# Altium schematic sheet MuxAddr_RAM.SchDoc
size A4
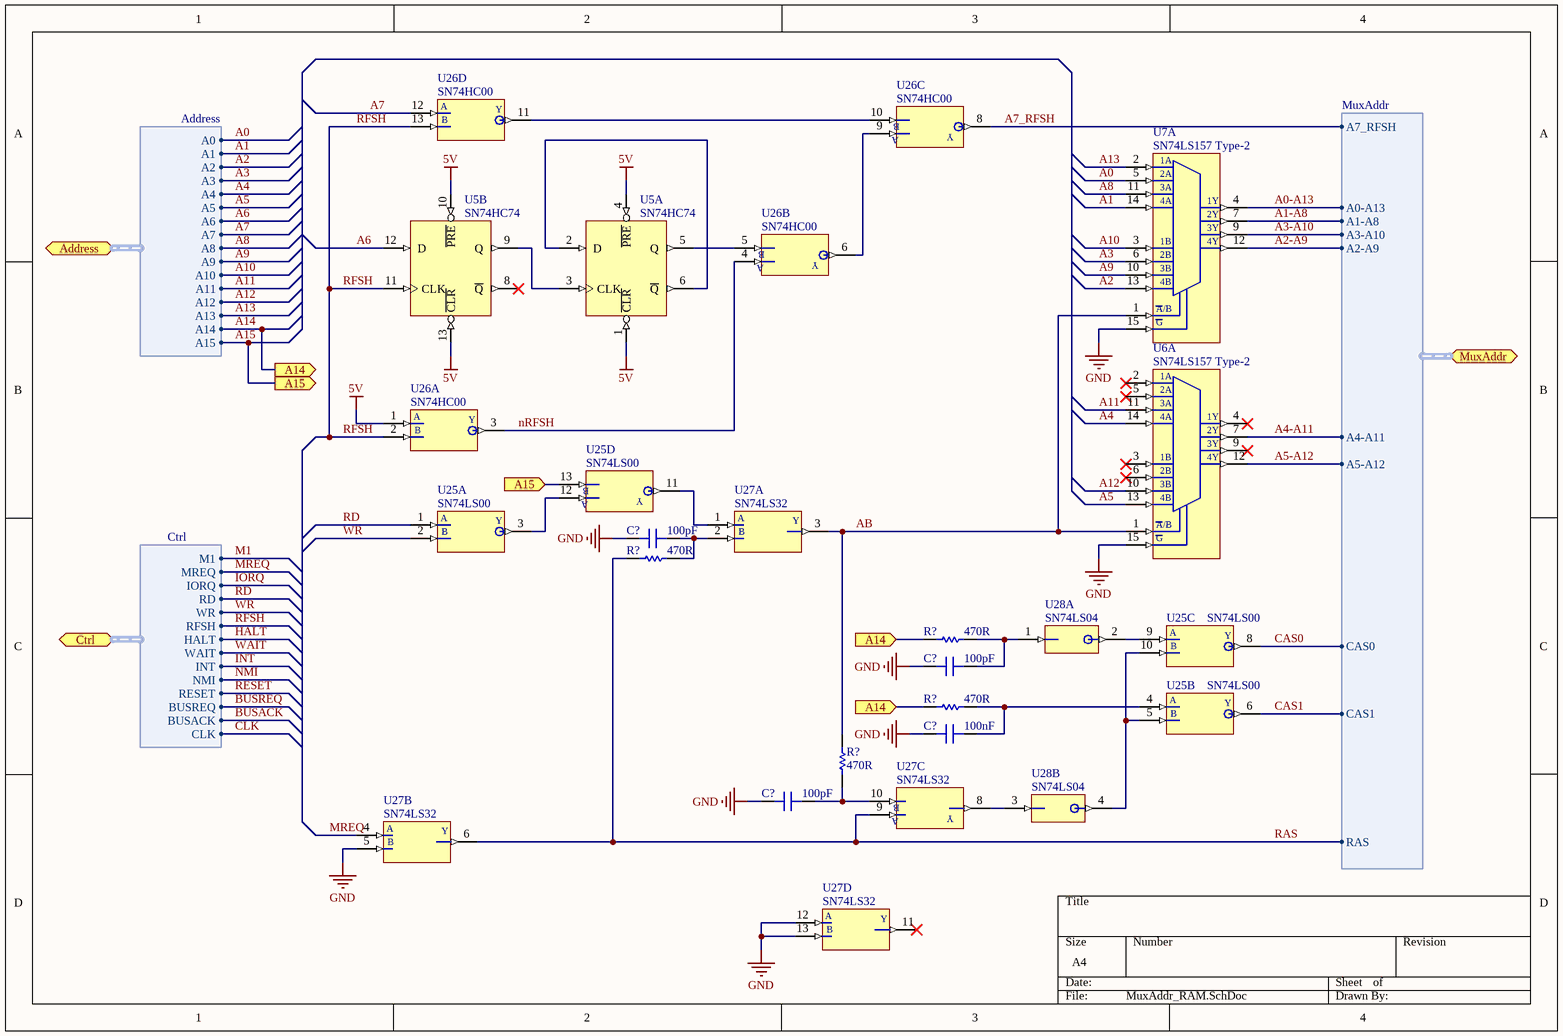
[diagram p0: MuxAddr_RAM.SchDoc]

## Parts
(Parts that share a designator on the sheet are numbered #1, #2 ... from top to bottom, then left to right.)
C?#1  100pF  [DiskCapacitor]
C?#2  100pF  [DiskCapacitor]
C?#3  100nF  [DiskCapacitor]
C?#4  100pF  [DiskCapacitor]
R?#1  470R  [CR25]
R?#2  470R  [CR25]
R?#3  470R  [CR25]
R?#4  470R  [CR25]
U5  SN74HC74  [TSSOP14]  (parts A,B of 3)
U6  SN74LS157 Type-2  [PDIP16]  (part A of 2)
U7  SN74LS157 Type-2  [PDIP16]  (part A of 2)
U25  SN74LS00  [TSSOP14]  (parts A,B,C,D of 5)
U26  SN74HC00  [TSSOP14]  (parts A,B,C,D of 5)
U27  SN74LS32  [CDIP14]  (parts A,B,C,D of 5)
U28  SN74LS04  [CDIP14]  (parts A,B of 7)

## Ports
A14 (in), A14 (out), A15 (in), A15 (out), Address (harness Address), Ctrl (harness Ctrl), MuxAddr (harness MuxAddr)

## Harnesses
Address: A0, A1, A2, A3, A4, A5, A6, A7, A8, A9, A10, A11, A12, A13, A14, A15
Ctrl: M1, MREQ, IORQ, RD, WR, RFSH, HALT, WAIT, INT, NMI, RESET, BUSREQ, BUSACK, CLK
MuxAddr: A0-A13, A1-A8, A3-A10, A2-A9, A4-A11, A5-A12, A7_RFSH, RAS, CAS0, CAS1

## Nets
5V: U5.1(~{CLR}) U5.4(~{PRE}) U5.10(~{PRE}) U5.13(~{CLR}) U26.1(A)
GND: C?#1.1 C?#2.1 C?#3.1 C?#4.1 U6.15(G) U7.15(G) U27.5(B) U27.12(A) U27.13(B)
A0: U7.5(2A) ; port Address.A0
A0-A13: U7.4(1Y) ; port MuxAddr.A0-A13
A1: U7.14(4A) ; port Address.A1
A1-A8: U7.7(2Y) ; port MuxAddr.A1-A8
A2: U7.13(4B) ; port Address.A2
A2-A9: U7.12(4Y) ; port MuxAddr.A2-A9
A3: U7.6(2B) ; port Address.A3
A3-A10: U7.9(3Y) ; port MuxAddr.A3-A10
A4: U6.14(4A) ; port Address.A4
A4-A11: U6.7(2Y) ; port MuxAddr.A4-A11
A5: U6.13(4B) ; port Address.A5
A5-A12: U6.12(4Y) ; port MuxAddr.A5-A12
A6: U5.12(D) ; port Address.A6
A7: U26.12(A) ; port Address.A7
A7_RFSH: U26.8(Y) ; port MuxAddr.A7_RFSH
A8: U7.11(3A) ; port Address.A8
A9: U7.10(3B) ; port Address.A9
A10: U7.3(1B) ; port Address.A10
A11: U6.11(3A) ; port Address.A11
A12: U6.10(3B) ; port Address.A12
A13: U7.2(1A) ; port Address.A13
A14: R?#2.2 R?#3.2 ; port A14, port Address.A14
A15: U25.13(B) ; port A15, port Address.A15
AB: R?#4.1 U6.1(A/B) U7.1(A/B) U27.3(Y)
BUSACK: port Ctrl.BUSACK
BUSREQ: port Ctrl.BUSREQ
CAS0: U25.8(Y) ; port MuxAddr.CAS0
CAS1: U25.6(Y) ; port MuxAddr.CAS1
CLK: port Ctrl.CLK
HALT: port Ctrl.HALT
INT: port Ctrl.INT
IORQ: port Ctrl.IORQ
M1: port Ctrl.M1
MREQ: U27.4(A) ; port Ctrl.MREQ
NMI: port Ctrl.NMI
nRFSH: U26.3(Y) U26.4(A)
RAS: R?#1.2 U27.6(Y) U27.9(A) ; port MuxAddr.RAS
RD: U25.1(A) ; port Ctrl.RD
RESET: port Ctrl.RESET
RFSH: U5.11(CLK) U26.2(B) U26.13(B) ; port Ctrl.RFSH
WAIT: port Ctrl.WAIT
WR: U25.2(B) ; port Ctrl.WR
NetC?#1_2: C?#1.2 R?#1.1 U27.2(B)
NetC?#2_2: C?#2.2 R?#2.1 U28.1(A)
NetC?#3_2: C?#3.2 R?#3.1 U25.4(A)
NetC?#4_2: C?#4.2 R?#4.2 U27.10(B)
NetU5_2: U5.2(D) U5.6(~{Q})
NetU5_3: U5.3(CLK) U5.9(Q)
NetU5_5: U5.5(Q) U26.5(B)
NetU25_3: U25.3(Y) U25.12(A)
NetU25_5: U25.5(B) U25.10(B) U28.4(Y)
NetU25_9: U25.9(A) U28.2(Y)
NetU25_11: U25.11(Y) U27.1(A)
NetU26_6: U26.6(Y) U26.9(A)
NetU26_10: U26.10(B) U26.11(Y)
NetU27_8: U27.8(Y) U28.3(A)

Not connected (* = marked no-connect by the designer): U5 8(~{Q})*; U6 2(1A)* 3(1B)* 4(1Y)* 5(2A)* 6(2B)* 9(3Y)*; U27 11(Y)*

## Library data of the parts
C?#1 C?#2 C?#4 = Capacitor
C?#3 = Capacitor: 100pF
R?#1-R?#4 = Resistor
U5 = SN74HC74: Dual D-Type Positive-Edge-Triggered Flip-Flops With Clear and Preset
U6 U7 = SN74HC157 Type-2: Quadruple 2-Line To 1-Line Data Selectors/Mutiplexers
U25 U26 = SN74HC00: Quadruple 2-Input Positive-NAND Gates
U27 = SN74HC32: Quadruple 2-Input Positive-OR Gates
U28 = SN74HC04: Hex Inverters